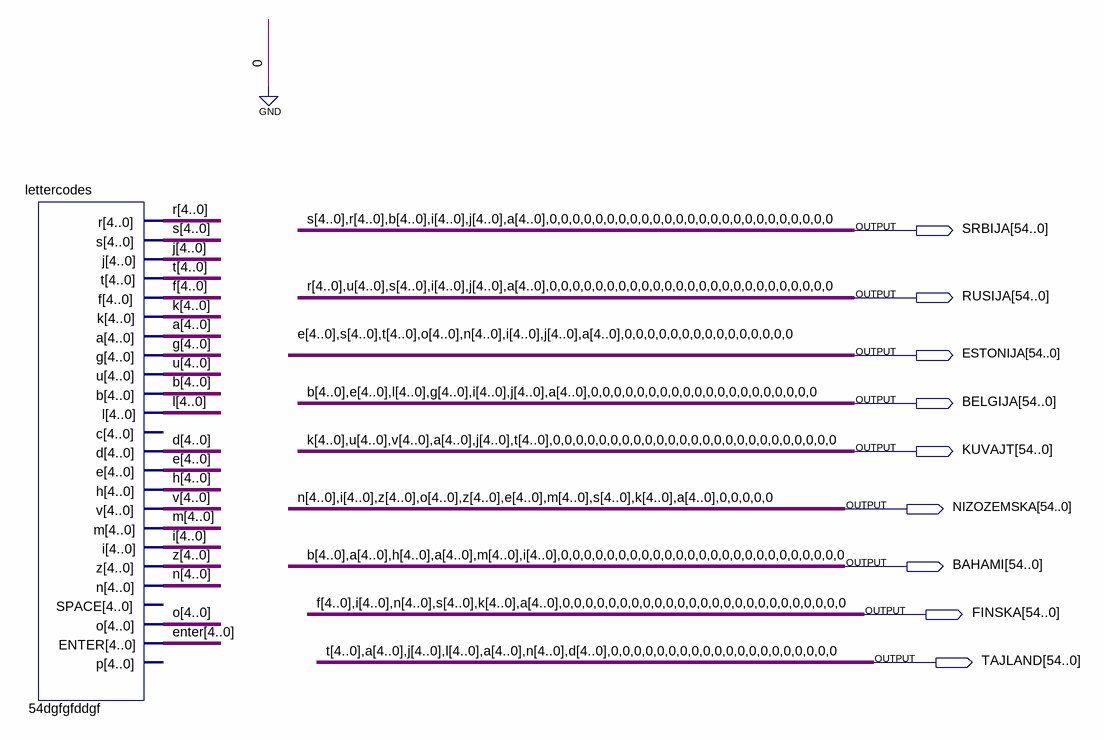
[diagram p0: schematic sheet]
// Quartus schematic countrycodes.bdf as structural Verilog: 1 symbols, 9 pins
module countrycodes (
  output [54:0] SRBIJA,
  output [54:0] RUSIJA,
  output [54:0] ESTONIJA,
  output [54:0] BELGIJA,
  output [54:0] KUVAJT,
  output [54:0] NIZOZEMSKA,
  output [54:0] BAHAMI,
  output [54:0] FINSKA,
  output [54:0] TAJLAND
);

  wire [4:0] enter;

  lettercodes u_54dgfgfddgf (
    .r(RUSIJA[54:50]), .s(ESTONIJA[49:45]), .j(BELGIJA[29:25]), .t(ESTONIJA[44:40]), .f(FINSKA[54:50]),
    .k(FINSKA[34:30]), .a(BAHAMI[49:45]), .g(BELGIJA[39:35]), .u(KUVAJT[49:45]), .b(BAHAMI[54:50]),
    .l(BELGIJA[44:40]), .d(TAJLAND[24:20]), .e(BELGIJA[49:45]), .h(BAHAMI[44:40]), .v(KUVAJT[44:40]),
    .m(BAHAMI[34:30]), .i(BAHAMI[29:25]), .z(NIZOZEMSKA[44:40]), .n(ESTONIJA[34:30]), .o(ESTONIJA[39:35]),
    .ENTER(enter));  // open: c, SPACE, p

  assign {BAHAMI[39:35], BAHAMI[24:0]} = {BAHAMI[49:45], {25{1'b0}}};
  assign {BELGIJA[54:50], BELGIJA[34:30], BELGIJA[24:0]} = {BAHAMI[54:50], BAHAMI[29:25], BAHAMI[49:45], {20{1'b0}}};
  assign {ESTONIJA[54:50], ESTONIJA[29:0]} = {BELGIJA[49:45], BAHAMI[29:25], BELGIJA[29:25], BAHAMI[49:45], {15{1'b0}}};
  assign {FINSKA[49:35], FINSKA[29:0]} = {BAHAMI[29:25], ESTONIJA[34:30], ESTONIJA[49:45], BAHAMI[49:45], {25{1'b0}}};
  assign {KUVAJT[54:50], KUVAJT[39:0]} = {FINSKA[34:30], BAHAMI[49:45], BELGIJA[29:25], ESTONIJA[44:40], {25{1'b0}}};
  assign {NIZOZEMSKA[54:45], NIZOZEMSKA[39:0]} = {ESTONIJA[34:30], BAHAMI[29:25], ESTONIJA[39:35], NIZOZEMSKA[44:40], BELGIJA[49:45], BAHAMI[34:30], ESTONIJA[49:45], FINSKA[34:30], BAHAMI[49:45], {5{1'b0}}};
  assign RUSIJA[49:0] = {KUVAJT[49:45], ESTONIJA[49:45], BAHAMI[29:25], BELGIJA[29:25], BAHAMI[49:45], {25{1'b0}}};
  assign SRBIJA = {ESTONIJA[49:45], RUSIJA[54:50], BAHAMI[54:50], BAHAMI[29:25], BELGIJA[29:25], BAHAMI[49:45], {25{1'b0}}};
  assign {TAJLAND[54:25], TAJLAND[19:0]} = {ESTONIJA[44:40], BAHAMI[49:45], BELGIJA[29:25], BELGIJA[44:40], BAHAMI[49:45], ESTONIJA[34:30], {20{1'b0}}};

  // Other names for the same wires on the sheet: a[4:0] = BAHAMI[49:45]; b[4:0] = BAHAMI[54:50];
  //   d[4:0] = TAJLAND[24:20]; e[4:0] = BELGIJA[49:45]; f[4:0] = FINSKA[54:50]; g[4:0] = BELGIJA[39:35];
  //   h[4:0] = BAHAMI[44:40]; i[4:0] = BAHAMI[29:25]; j[4:0] = BELGIJA[29:25]; k[4:0] = FINSKA[34:30];
  //   l[4:0] = BELGIJA[44:40]; m[4:0] = BAHAMI[34:30]; n[4:0] = ESTONIJA[34:30]; o[4:0] = ESTONIJA[39:35];
  //   r[4:0] = RUSIJA[54:50]; s[4:0] = ESTONIJA[49:45]; t[4:0] = ESTONIJA[44:40]; u[4:0] = KUVAJT[49:45];
  //   v[4:0] = KUVAJT[44:40]; z[4:0] = NIZOZEMSKA[44:40]
endmodule
